# EAGLE design STM32F2 Controller (EAGLE 6.3)
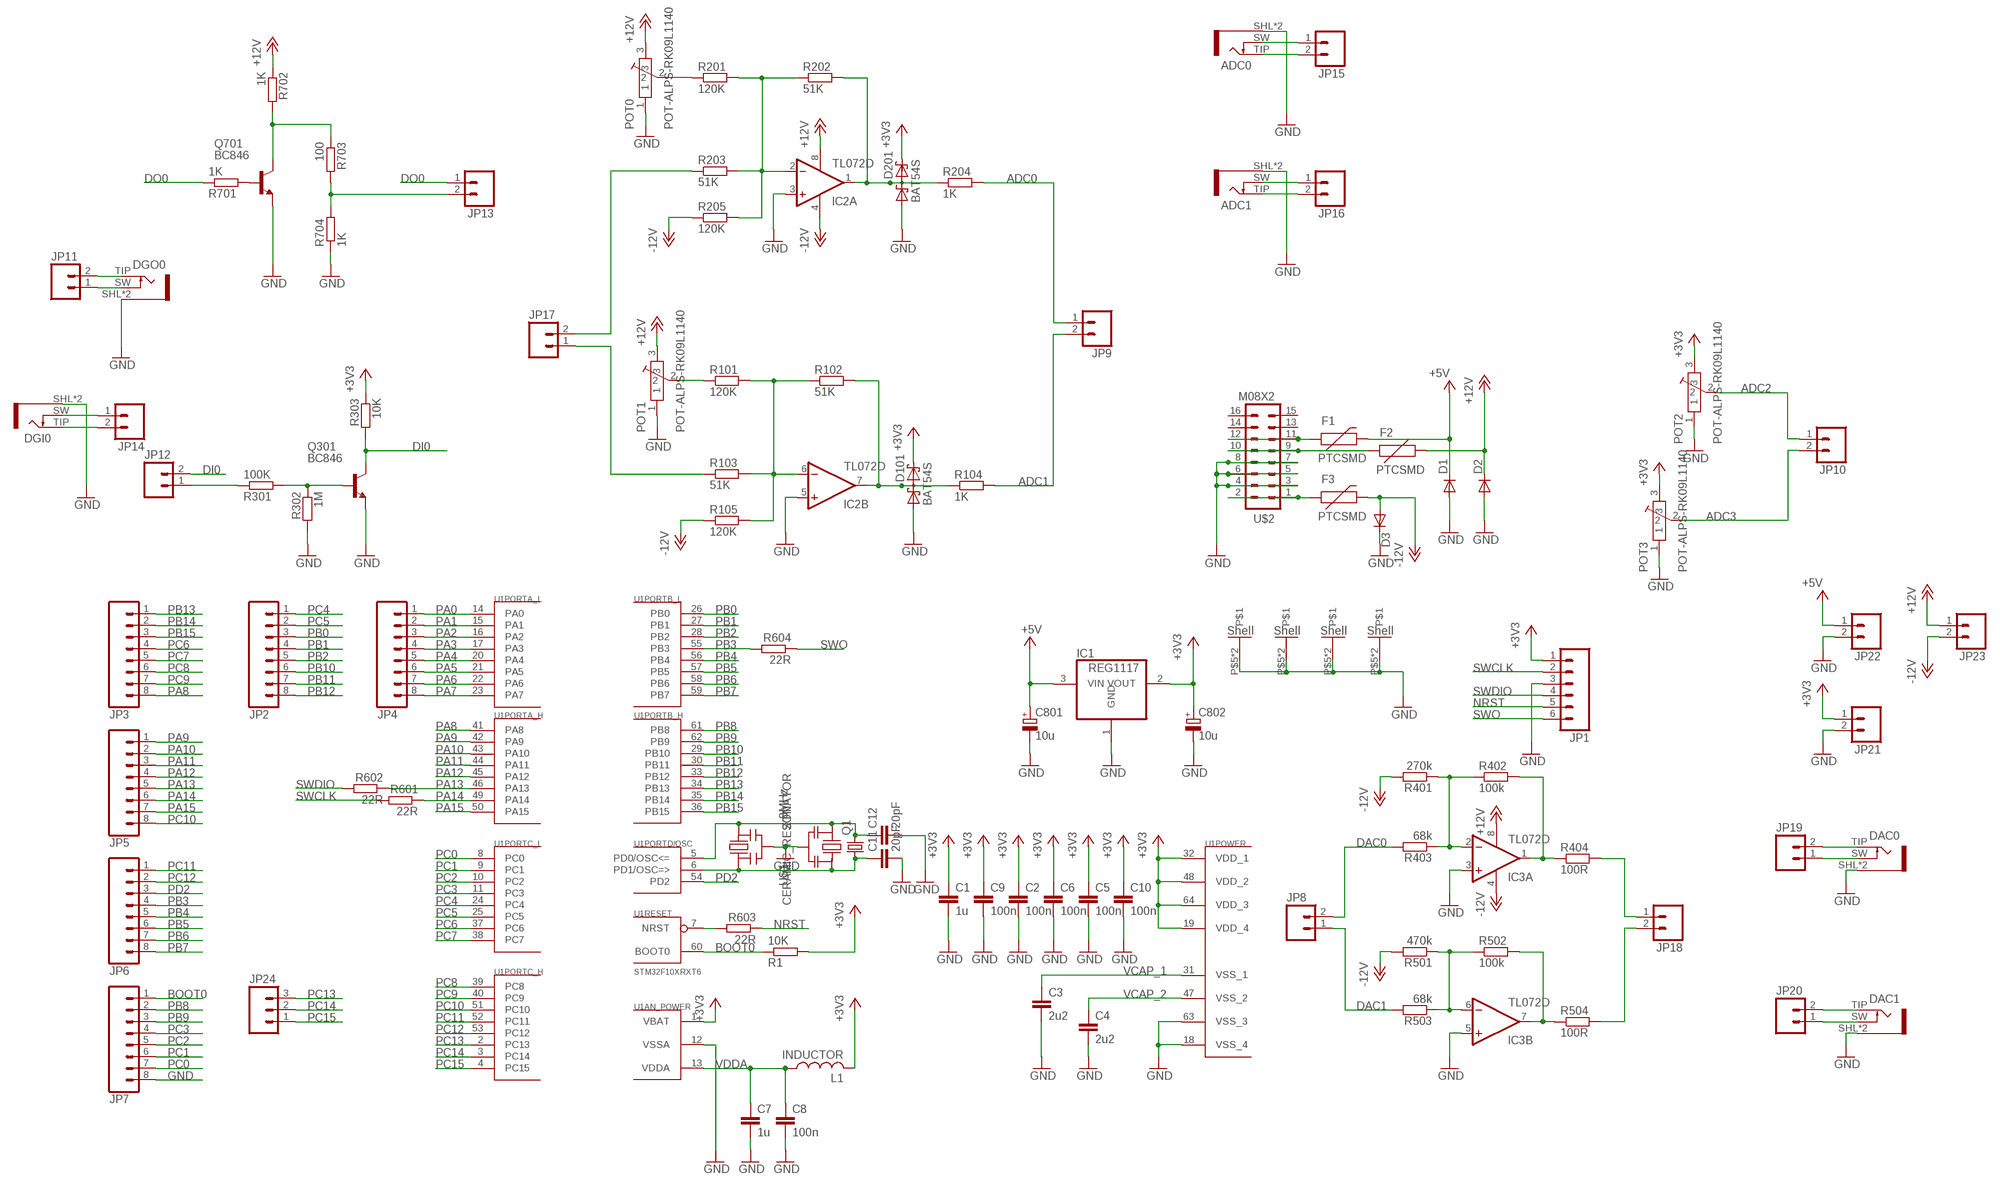
[diagram p0: schematic, sheet 1]

## Parts
ADC0  JACK-PJ-301B  [PJ-301B]
ADC1  JACK-PJ-301B  [PJ-301B]
C1  1u  C-EUC0603  [C0603]
C2  100n  C-EUC0603  [C0603]
C3  2u2  C-EUC0603  [C0603]
C4  2u2  C-EUC0603  [C0603]
C5  100n  C-EUC0603  [C0603]
C6  100n  C-EUC0603  [C0603]
C7  1u  C-EUC0603  [C0603]
C8  100n  C-EUC0603  [C0603]
C9  100n  C-EUC0603  [C0603]
C10  100n  C-EUC0603  [C0603]
C11  20pF  C-EUC0603  [C0603]
C12  20pF  C-EUC0603  [C0603]
C801  10u  CPOL-EUA  [PANASONIC_A]
C802  10u  CPOL-EUA  [PANASONIC_A]
D1  DIODESMA  [SMA-DIODE]
D2  DIODESMA  [SMA-DIODE]
D3  DIODESMA  [SMA-DIODE]
D101  BAT54S  [SOT23]
D201  BAT54S  [SOT23]
DAC0  JACK-PJ-301B  [PJ-301B]
DAC1  JACK-PJ-301B  [PJ-301B]
DGI0  JACK-PJ-301B  [PJ-301B]
DGO0  JACK-PJ-301B  [PJ-301B]
F1  PTCSMD  [PTC-1206]
F2  PTCSMD  [PTC-1206]
F3  PTCSMD  [PTC-1206]
IC1  REG1117  [SOT223]
IC2  TL072D  [SO08]
IC3  TL072D  [SO08]
JP1  M06SIP  [1X06]
JP2  M081X08  [1X08]
JP3  M081X08  [1X08]
JP4  M081X08  [1X08]
JP5  M081X08  [1X08]
JP6  M081X08  [1X08]
JP7  M081X08  [1X08]
JP8  M02PTH  [1X02]
JP9  M02PTH  [1X02]
JP10  M02PTH  [1X02]
JP11  M02PTH  [1X02]
JP12  M02PTH  [1X02]
JP13  M02PTH  [1X02]
JP14  M02PTH  [1X02]
JP15  M02PTH  [1X02]
JP16  M02PTH  [1X02]
JP17  M02PTH  [1X02]
JP18  M02PTH  [1X02]
JP19  M02PTH  [1X02]
JP20  M02PTH  [1X02]
JP21  M02PTH  [1X02]
JP22  M02PTH  [1X02]
JP23  M02PTH  [1X02]
JP24  M03PTH  [1X03]
L1  INDUCTOR  [0603]
POT0  POT-ALPS-RK09L1140  [POT-ALPS-RK09L1140]
POT1  POT-ALPS-RK09L1140  [POT-ALPS-RK09L1140]
POT2  POT-ALPS-RK09L1140  [POT-ALPS-RK09L1140]
POT3  POT-ALPS-RK09L1140  [POT-ALPS-RK09L1140]
Q1  CRYSTALHC49UP  [HC49UP]
Q301  BC846  [SOT23]
Q701  BC846  [SOT23]
R1  10K  R-EU_R0603  [R0603]
R101  120K  R-EU_R0603  [R0603]
R102  51K  R-EU_R0603  [R0603]
R103  51K  R-EU_R0603  [R0603]
R104  1K  R-EU_R0603  [R0603]
R105  120K  R-EU_R0603  [R0603]
R201  120K  R-EU_R0603  [R0603]
R202  51K  R-EU_R0603  [R0603]
R203  51K  R-EU_R0603  [R0603]
R204  1K  R-EU_R0603  [R0603]
R205  120K  R-EU_R0603  [R0603]
R301  100K  R-EU_R0603  [R0603]
R302  1M  R-EU_R0603  [R0603]
R303  10K  R-EU_R0603  [R0603]
R401  270k  R-EU_R0603  [R0603]
R402  100k  R-EU_R0603  [R0603]
R403  68k  R-EU_R0603  [R0603]
R404  100R  R-EU_R0603  [R0603]
R501  470k  R-EU_R0603  [R0603]
R502  100k  R-EU_R0603  [R0603]
R503  68k  R-EU_R0603  [R0603]
R504  100R  R-EU_R0603  [R0603]
R601  22R  R-EU_R0603  [R0603]
R602  22R  R-EU_R0603  [R0603]
R603  22R  R-EU_R0603  [R0603]
R604  22R  R-EU_R0603  [R0603]
R701  1K  R-EU_R0603  [R0603]
R702  1K  R-EU_R0603  [R0603]
R703  100  R-EU_R0603  [R0603]
R704  1K  R-EU_R0603  [R0603]
U1  STM32F10XRXT6  [TQFP64]
U$1  8MHz  CERMOSCILL-CSTCRG  [CSTCR-G]
U$2  M08X2  [2X8]
ZTT  CERAMIC_RESONATOR  [CSTCE_G_A]

## Nets
+3V3: C1.1 C2.1 C5.1 C6.1 C9.1 C10.1 C802.+ D101.2(C2) D201.2(C2) IC1.2(VOUT) JP1.1 JP21.1 L1.2 POT2.3 POT3.3 R1.2 R303.1 U1.1(AN_POWER:VBAT) U1.19(POWER:VDD_4) U1.32(POWER:VDD_1) U1.48(POWER:VDD_2) U1.64(POWER:VDD_3)
+5V: C801.+ D1.C F1.2 IC1.3(VIN) JP22.1
+12V: D2.C F2.2 IC2.8(P:V+) IC3.8(P:V+) JP23.1 POT0.3 POT1.3 R702.1
-12V: D3.A F3.2 IC2.4(P:V-) IC3.4(P:V-) JP23.2 R105.1 R205.1 R401.2 R501.2
ADC0: JP9.1 R204.2
ADC1: JP9.2 R104.2
ADC2: JP10.1 POT2.2
ADC3: JP10.2 POT3.2
BOOT0: JP7.1 R1.1 U1.60(RESET:BOOT0)
DAC0: JP8.2 R403.2
DAC1: JP8.1 R503.2
DI0: JP12.2 Q301.3(C) R303.2
DO0: JP13.1 R701.1
GND: ADC0.SHL(SLEEVE) ADC0.SLV(SLEEVE) ADC1.SHL(SLEEVE) ADC1.SLV(SLEEVE) C1.2 C2.2 C3.2 C4.2 C5.2 C6.2 C7.2 C8.2 C9.2 C10.2 C11.2 C12.2 C801.- C802.- D1.A D2.A D3.C D101.1(A1) D201.1(A1) DAC0.SHL(SLEEVE) DAC0.SLV(SLEEVE) DAC1.SHL(SLEEVE) DAC1.SLV(SLEEVE) DGI0.SHL(SLEEVE) DGI0.SLV(SLEEVE) DGO0.SHL(SLEEVE) DGO0.SLV(SLEEVE) IC1.1(GND) IC2.3(A:+IN) IC2.5(B:+IN) IC3.3(A:+IN) IC3.5(B:+IN) JP1.3 JP7.8 JP21.2 JP22.2 POT0.1 POT0.P$5 POT0.P$6 POT1.1 POT1.P$5 POT1.P$6 POT2.1 POT2.P$5 POT2.P$6 POT3.1 POT3.P$5 POT3.P$6 Q301.2(E) Q701.2(E) R302.2 R704.1 U1.12(AN_POWER:VSSA) U1.18(POWER:VSS_4) U1.63(POWER:VSS_3) U$1.2(GND) U$2.3 U$2.4 U$2.5 U$2.6 U$2.7 U$2.8 ZTT.P$2(GND)
N$1: ADC0.SW JP15.1
N$2: IC2.6(B:-IN) R101.2 R102.1 R103.2 R105.2
N$3: POT1.2 R101.1
N$4: D101.3(C1A2) IC2.7(B:OUT) R102.2 R104.1
N$5: IC3.7(B:OUT) R502.2 R504.1
N$6: F3.1 U$2.1 U$2.2
N$7: IC3.1(A:OUT) R402.2 R404.1
N$8: DAC0.SW JP19.1
N$9: DAC0.TIP JP19.2
N$10: DGO0.SW JP11.1
N$11: DGO0.TIP JP11.2
N$13: IC3.2(A:-IN) R401.1 R402.1 R403.1
N$14: IC2.2(A:-IN) R201.2 R202.1 R203.2 R205.2
N$15: POT0.2 R201.1
N$16: D201.3(C1A2) IC2.1(A:OUT) R202.2 R204.1
N$17: ADC0.TIP JP15.2
N$18: IC3.6(B:-IN) R501.1 R502.1 R503.1
N$19: C12.1 Q1.2 U1.5(PORTD/OSC:PD0/OSC<=) U$1.3(OUT) ZTT.P$1(IN)
N$20: C11.1 Q1.1 U1.6(PORTD/OSC:PD1/OSC=>) U$1.1(IN) ZTT.P$3(OUT)
N$21: JP12.1 R301.1
N$22: DGI0.SW JP14.1
N$23: DGI0.TIP JP14.2
N$24: ADC1.SW JP16.1
N$25: ADC1.TIP JP16.2
N$26: JP17.2 R203.1
N$27: Q301.1(B) R301.2 R302.1
N$28: JP17.1 R103.1
N$29: DAC1.SW JP20.1
N$30: DAC1.TIP JP20.2
N$31: JP18.1 R404.2
N$32: JP18.2 R504.2
N$34: Q701.1(B) R701.2
N$35: JP13.2 R703.2 R704.2
N$38: Q701.3(C) R702.2 R703.1
N$44: F1.1 U$2.11 U$2.12
N$45: F2.1 U$2.9 U$2.10
NRST: JP1.5 R603.1
PA0: JP4.1 U1.14(PORTA_L:PA0)
PA1: JP4.2 U1.15(PORTA_L:PA1)
PA2: JP4.3 U1.16(PORTA_L:PA2)
PA3: JP4.4 U1.17(PORTA_L:PA3)
PA4: JP4.5 U1.20(PORTA_L:PA4)
PA5: JP4.6 U1.21(PORTA_L:PA5)
PA6: JP4.7 U1.22(PORTA_L:PA6)
PA7: JP4.8 U1.23(PORTA_L:PA7)
PA8: JP3.8 U1.41(PORTA_H:PA8)
PA9: JP5.1 U1.42(PORTA_H:PA9)
PA10: JP5.2 U1.43(PORTA_H:PA10)
PA11: JP5.3 U1.44(PORTA_H:PA11)
PA12: JP5.4 U1.45(PORTA_H:PA12)
PA13: JP5.5 R602.1 U1.46(PORTA_H:PA13)
PA14: JP5.6 R601.1 U1.49(PORTA_H:PA14)
PA15: JP5.7 U1.50(PORTA_H:PA15)
PB0: JP2.3 U1.26(PORTB_L:PB0)
PB1: JP2.4 U1.27(PORTB_L:PB1)
PB2: JP2.5 U1.28(PORTB_L:PB2)
PB3: JP6.4 R604.2 U1.55(PORTB_L:PB3)
PB4: JP6.5 U1.56(PORTB_L:PB4)
PB5: JP6.6 U1.57(PORTB_L:PB5)
PB6: JP6.7 U1.58(PORTB_L:PB6)
PB7: JP6.8 U1.59(PORTB_L:PB7)
PB8: JP7.2 U1.61(PORTB_H:PB8)
PB9: JP7.3 U1.62(PORTB_H:PB9)
PB10: JP2.6 U1.29(PORTB_H:PB10)
PB11: JP2.7 U1.30(PORTB_H:PB11)
PB12: JP2.8 U1.33(PORTB_H:PB12)
PB13: JP3.1 U1.34(PORTB_H:PB13)
PB14: JP3.2 U1.35(PORTB_H:PB14)
PB15: JP3.3 U1.36(PORTB_H:PB15)
PC0: JP7.7 U1.8(PORTC_L:PC0)
PC1: JP7.6 U1.9(PORTC_L:PC1)
PC2: JP7.5 U1.10(PORTC_L:PC2)
PC3: JP7.4 U1.11(PORTC_L:PC3)
PC4: JP2.1 U1.24(PORTC_L:PC4)
PC5: JP2.2 U1.25(PORTC_L:PC5)
PC6: JP3.4 U1.37(PORTC_L:PC6)
PC7: JP3.5 U1.38(PORTC_L:PC7)
PC8: JP3.6 U1.39(PORTC_H:PC8)
PC9: JP3.7 U1.40(PORTC_H:PC9)
PC10: JP5.8 U1.51(PORTC_H:PC10)
PC11: JP6.1 U1.52(PORTC_H:PC11)
PC12: JP6.2 U1.53(PORTC_H:PC12)
PC13: JP24.3 U1.2(PORTC_H:PC13)
PC14: JP24.2 U1.3(PORTC_H:PC14)
PC15: JP24.1 U1.4(PORTC_H:PC15)
PD2: JP6.3 U1.54(PORTD/OSC:PD2)
RST: R603.2 U1.7(RESET:NRST)
SWCLK: JP1.2 R601.2
SWDIO: JP1.4 R602.2
SWO: JP1.6 R604.1
VCAP_1: C3.1 U1.31(POWER:VSS_1)
VCAP_2: C4.1 U1.47(POWER:VSS_2)
VDDA: C7.1 C8.1 L1.1 U1.13(AN_POWER:VDDA)
Unconnected: U$2.13 U$2.14 U$2.15 U$2.16

## Library data of the parts
ADC0 ADC1 DAC0 DAC1 DGI0 DGO0 = Rebel:JACK-PJ-301B
C1-C12 = resistor:C-EU: CAPACITOR, European symbol
C801 C802 = resistor:CPOL-EU: POLARIZED CAPACITOR, European symbol
D1-D3 = SparkFun:DIODE: Diode These are standard reverse protection diodes and small signal diodes. SMA package can handle up to about 1A. SOD-323 can handle about 200mA. What the SOD-323 package when ordering, there are some mfgs out there that are 5-pin packages.
D101 D201 = diode:BAT54S: Schottky Diodes Pin connection corrected 2011-05-04 Source: Fairchild .. BAT54.pdf
F1-F3 = SparkFun:PTC: Resettable Fuse PTC Resettable Fuse. Spark Fun Electronics SKU : COM-08357
IC1 = burr-brown:REG1117: 800mA and 1A Low Dropout (LDO) Positive Regulator 1.8V, 2.5V, 2.85V, 3.3V, 5V, and Adj; MPN: REG1117; OC_FARNELL: 1097566; OC_NEWARK: 14P6981
IC2 IC3 = linear:TL072: OP AMP
JP1 = SparkFun:M06: Header 6 Standard 6-pin 0.1" header. Use with straight break away headers (SKU : PRT-00116), right angle break away headers (PRT-00553), swiss pins (PRT-00743), machine pins (PRT-00117), and female headers (PRT-00115). Molex polarized connector foot print use with SKU : PRT-08094 with associated crimp pins and housings. NOTES ON THE VARIANTS LOCK and LOCK_LONGPADS... This footprint was designed to help hold the alignment of a through-hole component (i.e. 6-pin header) while soldering it into place. You may notice that each hole has been shifted either up or down by 0.005 of an inch from it's more standard position (which is a perfectly straight line). This slight alteration caused the pins (the squares in the middle) to touch the edges of the holes. Because they are alternating, it causes a "brace" to hold the component in place. 0.005 has proven to be the perfect amount of "off-center" position when using our standard breakaway headers. Although looks a little odd when you look at the bare footprint, once you have a header in there, the alteration is very hard to notice. Also, if you push a header all the way into place, it is covered up entirely on the bottom side. This idea of altering the position of holes to aid alignment will be further integrated into the Sparkfun Library for other footprints. It can help hold any component with 3 or more connection pins.
JP2-JP7 = SparkFun:M08: Header 8 Standard 8-pin 0.1" header. Use with straight break away headers (SKU : PRT-00116), right angle break away headers (PRT-00553), swiss pins (PRT-00743), machine pins (PRT-00117), and female headers (PRT-00115).
JP8-JP23 = SparkFun:M02: Header 2 Standard 2-pin 0.1" header. Use with straight break away headers (SKU : PRT-00116), right angle break away headers (PRT-00553), swiss pins (PRT-00743), machine pins (PRT-00117), and female headers (PRT-00115). Molex polarized connector foot print use with SKU : PRT-08233 with associated crimp pins and housings.
JP24 = SparkFun:M03: Header 3 Standard 3-pin 0.1" header. Use with straight break away headers (SKU : PRT-00116), right angle break away headers (PRT-00553), swiss pins (PRT-00743), machine pins (PRT-00117), and female headers (PRT-00115). Molex polarized connector foot print use with SKU : PRT-08232 with associated crimp pins and housings.
L1 = Rebel:INDUCTOR
POT0 POT1-POT3 = Rebel:POT-ALPS-RK09L
Q1 = crystal:CRYSTAL: CRYSTAL; OC_FARNELL: unknown; OC_NEWARK: unknown
Q301 Q701 = transistor:BC846: NPN TRANSISTOR
R1 R101-R105 R201-R205 R301-R303 R401-R404 R501-R504 R601-R604 R701-R704 = resistor:R-EU_: RESISTOR, European symbol
U1 = stm32:STM32F10XRXT6: STM32F101/103 64pin LQFP
U$1 = adafruit:CERMOSCILL: Ceramic oscillator with built in capacitors such as ZTT-12MHz http://www.ladyada.net/library/eagle
U$2 = SparkFun:M08X2
ZTT = Rebel:CERAMIC_RESONATOR: Murata Ceralock Ceramic Resonators. CSTCC_G 2.00 - 3.99MHz CSTCR_G 4.00 - 7.99MHz CSTCE_G 8.00 - 13.99MHz

## Board
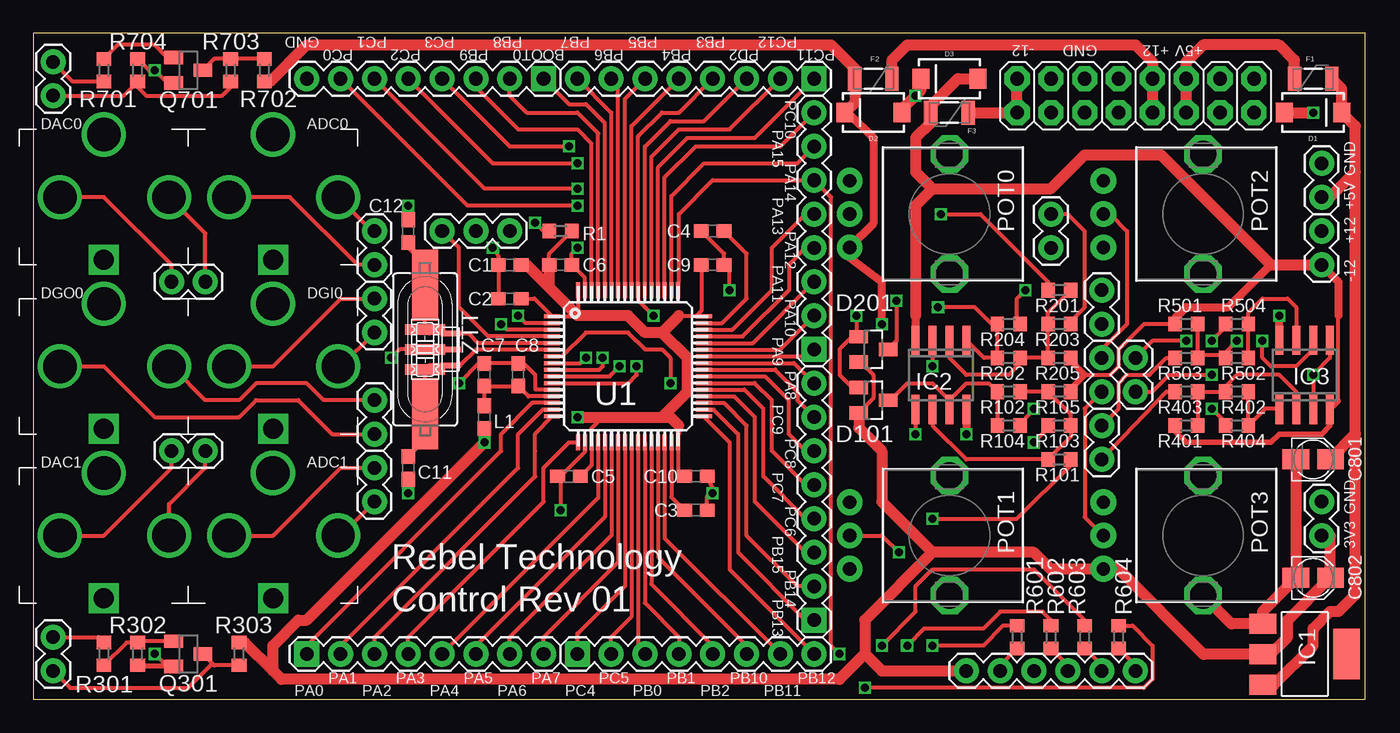
[diagram p1: board, top side]
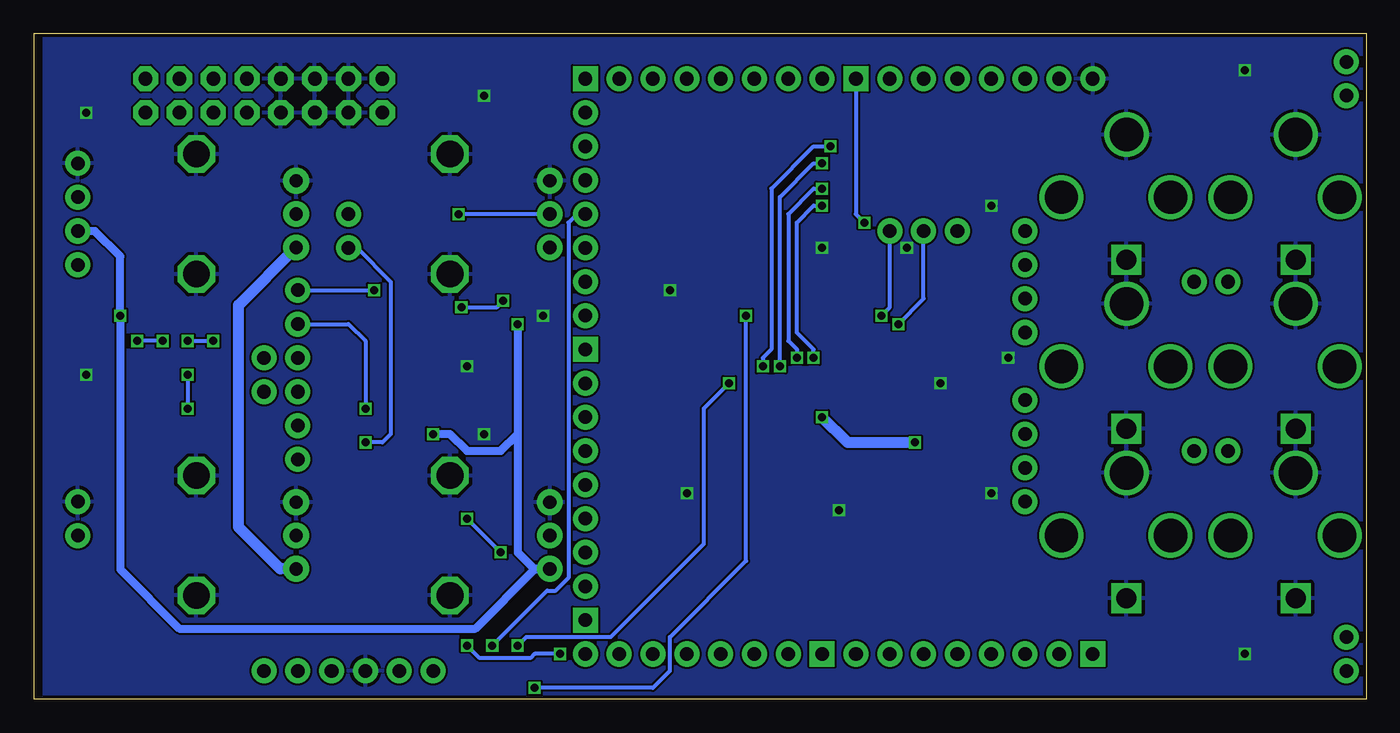
[diagram p2: board, bottom side, seen from below]

Size 100 x 50 mm. Coordinates in mm from the lower left corner, seen from the top.
Outline: 0,0 100,0 100,50 0,50 0,0
Copper layers (1*16): Top 0.035mm / dielectric 1.5mm / Bottom 0.035mm
Design rules "Rebel *": minimum track width 6mil, minimum drill 12mil, track to track 6mil, track to pad 6mil, pad to pad 6mil, via to via 6mil, smd to smd 0mil, copper to edge 10mil, drill to drill 10mil, minimum pad ring 12mil, minimum via ring 6mil, stop-mask expansion 2mil, vias tented up to drill 100mil, thermal gap 10mil

### Footprints (pad centres in the part's own frame; a part is rotated, then mirrored left to right if it is on the bottom)
PJ-301B = drill 1.5 square: SHL 4.7,0 | drill 2.5: SLV -4.7,0; SW 0,-3.3; TIP 0,4.9
C0603 = smd 1.1 x 1: 1 -0.85,0; 2 0.85,0
PANASONIC_A = smd 2 x 1.5: + 1.3,0; - -1.3,0
SMA-DIODE = smd 1.27 x 1.47: A -2.15,0; C 2.15,0
SOT23 = smd 1 x 1.4: 1 -0.95,-1.1; 2 0.95,-1.1; 3 0,1.1
PTC-1206 = smd 1 x 1.8: 1 -1.4,0; 2 1.4,0
SOT223 = smd 1.499 x 2.007: 1 -2.261,-3.15; 2 0.025,-3.15; 3 2.311,-3.15 | smd 3.81 x 2.007: 4 0,3.15
SO08 = smd 0.6 x 2.2: 1 -1.905,-2.6; 2 -0.635,-2.6; 3 0.635,-2.6; 4 1.905,-2.6; 5 1.905,2.6; 6 0.635,2.6; 7 -0.635,2.6; 8 -1.905,2.6
1X06 = drill 1.016 pad 1.88: 1 0,0; 2 2.54,0; 3 5.08,0; 4 7.62,0; 5 10.16,0; 6 12.7,0
1X08 = drill 1.016 pad 1.88 square: 1 0,0 | drill 1.016 pad 1.88: 2 2.54,0; 3 5.08,0; 4 7.62,0; 5 10.16,0; 6 12.7,0; 7 15.24,0; 8 17.78,0
1X02 = drill 1.016 pad 1.88: 1 0,0; 2 2.54,0
1X03 = drill 1.016 pad 1.88: 1 0,0; 2 2.54,0; 3 5.08,0
0603 = smd 1.1 x 1: 1 -0.85,0; 2 0.85,0
POT-ALPS-RK09L1140 = drill 1 pad 1.93: 1 -2.5,-7.5; 2 0,-7.5; 3 2.5,-7.5 | drill 2 octagon: P$5 -4.5,0; P$6 4.5,0
HC49UP = smd 5.334 x 1.93: 1 -4.826,0; 2 4.826,0
R0603 = smd 1 x 1.1: 1 -0.85,0; 2 0.85,0
TQFP64 = smd 1.2 x 0.3: 1 -5.7,3.75; 2 -5.7,3.25; 3 -5.7,2.75; 4 -5.7,2.25; 5 -5.7,1.75; 6 -5.7,1.25; 7 -5.7,0.75; 8 -5.7,0.25; 9 -5.7,-0.25; 10 -5.7,-0.75; 11 -5.7,-1.25; 12 -5.7,-1.75; 13 -5.7,-2.25; 14 -5.7,-2.75; 15 -5.7,-3.25; 16 -5.7,-3.75; 33 5.7,-3.75; 34 5.7,-3.25; 35 5.7,-2.75; 36 5.7,-2.25; 37 5.7,-1.75; 38 5.7,-1.25; 39 5.7,-0.75; 40 5.7,-0.25; 41 5.7,0.25; 42 5.7,0.75; 43 5.7,1.25; 44 5.7,1.75; 45 5.7,2.25; 46 5.7,2.75; 47 5.7,3.25; 48 5.7,3.75 | smd 0.3 x 1.2: 17 -3.75,-5.7; 18 -3.25,-5.7; 19 -2.75,-5.7; 20 -2.25,-5.7; 21 -1.75,-5.7; 22 -1.25,-5.7; 23 -0.75,-5.7; 24 -0.25,-5.7; 25 0.25,-5.7; 26 0.75,-5.7; 27 1.25,-5.7; 28 1.75,-5.7; 29 2.25,-5.7; 30 2.75,-5.7; 31 3.25,-5.7; 32 3.75,-5.7; 49 3.75,5.7; 50 3.25,5.7; 51 2.75,5.7; 52 2.25,5.7; 53 1.75,5.7; 54 1.25,5.7; 55 0.75,5.7; 56 0.25,5.7; 57 -0.25,5.7; 58 -0.75,5.7; 59 -1.25,5.7; 60 -1.75,5.7; 61 -2.25,5.7; 62 -2.75,5.7; 63 -3.25,5.7; 64 -3.75,5.7
CSTCR-G = smd 0.8 x 3: 1 -1.5,0; 2 0,0; 3 1.5,0
2X8 = drill 1.016 pad 1.88 octagon: 1 0,0; 2 0,2.54; 3 2.54,0; 4 2.54,2.54; 5 5.08,0; 6 5.08,2.54; 7 7.62,0; 8 7.62,2.54; 9 10.16,0; 10 10.16,2.54; 11 12.7,0; 12 12.7,2.54; 13 15.24,0; 14 15.24,2.54; 15 17.78,0; 16 17.78,2.54
CSTCE_G_A = smd 0.4 x 1.5: P$1 -1.2,0; P$2 0,0; P$3 1.2,0

### Placement (x,y rotation side)
ADC0  18,37.7 270 top
ADC1  18,12.3 270 top
C1  35.78,32.62 180 top
C2  35.78,30.08 180 top
C3  49.75,14.21 0 top
C4  51.02,35.16 180 top
C5  40.22,16.75 180 top
C6  39.59,32.62 0 top
C7  33.87,24.37 90 top
C8  36.41,24.37 90 top
C9  51.02,32.62 0 top
C10  49.75,16.75 0 top
C11  28.16,17.38 270 top
C12  28.16,35.16 90 top
C801  96.1,18.02 0 top
C802  96.1,9.12 0 top
D1  96.1,44.05 0 top
D2  63.08,44.05 180 top
D3  68.8,46.59 180 top
D101  63.08,22.46 270 top
D201  63.08,26.27 270 top
DAC0  5.3,37.7 270 top
DAC1  5.3,12.3 270 top
DGI0  18,25 270 top
DGO0  5.3,25 270 top
F1  96.1,46.59 0 top
F2  63.08,46.59 180 top
F3  68.8,44.05 180 top
IC1  95.47,3.41 270 top
IC2  68.16,24.37 180 top
IC3  95.47,24.37 0 top
JP1  70.07,2.14 0 top
JP2  40.86,3.41 0 top
JP3  58.64,5.95 90 top
JP4  20.54,3.41 0 top
JP5  58.64,26.27 90 top
JP6  58.64,46.59 180 top
JP7  38.32,46.59 180 top
JP8  80.23,20.55 270 top
JP9  80.23,30.71 270 top
JP10  80.23,25.64 270 top
JP11  25.62,19.92 90 top
JP12  1.49,4.68 270 top
JP13  1.49,47.86 270 top
JP14  25.62,30.08 270 top
JP15  25.62,32.62 90 top
JP16  25.62,17.38 270 top
JP17  76.42,33.89 90 top
JP18  82.77,23.1 90 top
JP19  10.38,31.35 0 top
JP20  10.38,18.65 0 top
JP21  96.74,12.3 90 top
JP22  96.74,37.7 90 top
JP23  96.74,35.16 270 top
JP24  30.7,35.16 0 top
L1  33.87,21.19 270 top
POT0  68.8,36.43 270 top
POT1  68.8,12.3 270 top
POT2  87.85,36.43 270 top
POT3  87.85,12.3 270 top
Q1  29.43,26.27 90 top
Q301  11.65,3.41 270 top
Q701  11.65,47.23 270 top
R1  39.59,35.16 0 top
R101  77.05,18.02 180 top
R102  73.24,23.1 180 top
R103  77.05,20.55 0 top
R104  73.24,20.55 0 top
R105  77.05,23.1 180 top
R201  77.05,30.71 0 top
R202  73.24,25.64 180 top
R203  77.05,28.18 180 top
R204  73.24,28.18 0 top
R205  77.05,25.64 180 top
R301  5.3,3.41 270 top
R302  7.84,3.41 270 top
R303  15.46,3.41 270 top
R401  86.58,20.55 180 top
R402  90.39,23.1 0 top
R403  86.58,23.1 180 top
R404  90.39,20.55 180 top
R501  86.58,28.18 180 top
R502  90.39,25.64 0 top
R503  86.58,25.64 180 top
R504  90.39,28.18 180 top
R601  73.88,4.68 270 top
R602  76.42,4.68 270 top
R603  78.96,4.68 90 top
R604  81.5,4.68 90 top
R701  5.3,47.23 90 top
R702  17.36,47.23 90 top
R703  14.82,47.23 270 top
R704  7.84,47.23 270 top
U1  44.67,25 0 top
U$1  29.43,26.27 90 top
U$2  73.88,44.05 0 top
U$3  [RT-LOGO-35MM-BL]  51.97,43.73 270 top
ZTT  31.33,26.27 270 top

### Tracks (layer width: path | path; a pad name or v marks a point on that pad's centre or on a via)
+3V3  (via drill 0.6)
  Top 0.305: C5.1 41.92,17.59 U1.19 41.92,20.35 42.76,21.19 47.21,21.19 | C10.1 48.42,17.23 U1.32 48.42,20.5 48.48,20.55 48.48,19.92 | D201.2 62.13,25.32 63.08,24.37 63.08,22.61 D101.2 | 42.07,28.75 44.67,28.81 | U1.64 40.92,28.87 40.86,28.81 40.8,28.75 U1.1 37.64,30.08 C2.1 | C6.1 38.74,33.46 R1.2 | C9.1 50.17,29.17 49.75,28.75 | U1.48 49.75,28.75 | 49.75,28.75 48.54,28.75 48.48,28.81
  Top 0.813: 80.39,9.76 81.5,9.76 87.87,3.39 IC1.2 92.9,3.39 94.2,4.68 94.2,5.95 97.4,9.15 C802.+ 97.4,12.27 JP21.1 | 80.39,9.76 POT3.3 | 80.39,9.76 76.42,9.76 75.15,11.03 67.53,11.03 | 67.53,11.03 62.45,5.95 62.45,3.41 | 62.45,3.41 60.54,1.5 18.63,1.5 18,2.14 | D101.2 61.98,20.39 63.72,18.65 63.72,14.84 67.53,11.03 | v40.86,21.19 47.21,21.19 | 47.21,21.19 47.84,21.19 48.48,20.55 | 47.21,21.19 49.11,23.1 49.11,25.64 47.21,27.54 | 18,2.14 18,4.04 19.9,5.95 20.54,5.95 v33.87,19.29 L1.2 | R303.1 15.88,4.26 18,2.14 | 62.45,3.41 63.72,2.14 JP1.1 | 47.21,27.54 45.94,27.54 44.67,28.81 40.86,28.81 38.74,30.93 | 38.74,30.93 37.05,32.62 C1.1 | 47.21,27.54 48.48,28.81 | C6.1 38.74,30.93
  Bottom 0.813: POT3.3 81.54,9.8 84.67,12.94 84.67,29.61 POT2.3 | v40.86,21.19 38.95,19.29 v33.87,19.29
+5V
  Top 0.813: F1.2 98.25,45.84 D1.C 99.28,43.02 99.28,39.61 | IC1.3 93.16,1.1 96.1,4.04 96.1,5.31 97.37,6.58 98.01,6.58 99.28,7.86 99.28,19.95 | 99.28,19.95 C801.+ | 99.28,19.95 99.28,39.61 | JP22.1 97.37,37.7 99.28,39.61
+12V  (via drill 0.6)
  Top 0.61: D2.C 61.18,44.05 63.08,42.15 63.08,35.72 POT0.3 61.18,33.81 61.18,33.26 63.72,31.35 v63.72,28.18 | IC2.8 v70.07,19.92 | IC3.8 v93.56,28.81
  Top 0.813: R702.1 17.78,46.38 20.54,49.13 59.91,49.13 61.68,47.36 F2.2 61.68,44.8 D2.C
  Bottom 0.61: v63.72,28.18 63.72,19.92 | 63.72,19.92 63.72,11.03 62.45,9.76 | 63.72,19.92 64.99,18.65 67.53,18.65 68.8,19.92 v70.07,19.92 | JP23.1 95.47,35.16 93.56,33.26 v93.56,28.81 93.56,9.76 89.12,5.31 66.89,5.31 62.45,9.76 | 62.45,9.76 61.34,9.76 POT1.3 62.41,9.8 62.45,9.76
-12V
  Top 0.305: 98.01,22.4 98.01,28.81 | 78.96,24.37 80.86,24.37 81.5,25 81.5,26.27 83.4,28.18 R501.2 85.73,28.6
  Top 0.406: R401.2 85.73,20.14 86.58,19.29 92.93,19.29 93.56,19.92 96.74,19.92 97.37,20.55 IC3.4 98.01,22.4 | R205.1 77.9,25.42 78.96,24.37 77.9,23.31 R105.1
  Top 0.61: F3.2 67.4,43.29 | 66.26,28.81 IC2.4 | 85.73,28.6 86.58,29.45 89.75,29.45 92.93,32.62 | JP23.2 98.01,31.35 98.01,28.81
  Top 0.813: F3.2 67.4,44.55 69.43,46.59 D3.A | 67.4,43.29 66.26,42.15 66.26,39.61 67.53,38.34 | 67.53,38.34 76.42,38.34 78.96,40.88 84.67,40.88 92.93,32.62 JP23.2 | 66.26,28.81 66.26,37.07 67.53,38.34
ADC0  (via drill 0.6)
  Top 0.305: R204.2 73.88,28.39 73.88,30.08 v74.51,30.71
  Bottom 0.305: JP9.1 v74.51,30.71
ADC1  (via drill 0.6)
  Top 0.305: v75.15,21.83 73.88,20.34 R104.2
  Bottom 0.305: JP9.2 76.42,28.18 75.15,26.91 v75.15,21.83
ADC2
  Top 0.305: POT2.2 80.86,36.43 82.13,35.16 82.13,28.18 80.23,26.27 JP10.1
ADC3
  Top 0.305: JP10.2 78.96,21.83 78.96,13.69 POT3.2
BOOT0  (via drill 0.6)
  Top 0.305: U1.60 42.92,43.26 41.49,44.69 40.22,44.69 JP7.1 | R1.1 38.32,35.16 v37.68,35.8
  Bottom 0.305: JP7.1 38.32,36.43 v37.68,35.8
DAC0
  Top 0.305: JP8.2 85.09,23.1 R403.2
DAC1
  Top 0.305: R503.2 85.09,25.64 83.82,24.37 82.13,24.37 81.5,23.73 81.5,21.83 JP8.1
DI0
  Top 0.305: R303.2 13.6,2.56 | 13.6,2.56 Q301.3 | JP12.2 2.76,0.87 11.65,0.87 13.34,2.56 13.6,2.56
DO0
  Top 0.305: R701.1 2.97,46.38 JP13.1
GND  (via drill 0.6)
  Top 0.305: U1.63 41.42,31.64 C6.2 40.44,33.47 v40.86,33.89 | IC3.5 97.37,25.64 v96.1,24.37 IC3.3 | IC2.3 v67.53,25 | IC2.5 v66.26,19.92 | D101.1 61.5,23.41 60.54,24.37 60.54,26.27 61.49,27.22 D201.1 61.81,27.39 v61.81,28.81 | Q301.2 7.94,2.46 R302.2 10.16,2.56 10.38,2.77 9.74,2.77 v9.11,3.41 | Q701.2 10.06,46.27 v9.11,47.23 8.69,47.23 R704.1 | C10.2 51.02,15.9 v51.02,15.47 50.6,15.26 C3.2 | C5.2 39.37,16.53 39.59,16.75 | v52.29,30.71 52.29,32.2 C9.2 51.87,33.46 C4.2 | v31.97,23.73 33.45,25.21 C7.2 C8.2 36.83,25.21 37.68,24.37 37.68,23.31 37.74,23.25 U1.12 | C2.2 C1.2 34.93,33.26 v34.51,33.89 | U1.18 41.42,18.58 39.59,16.75 | 39.59,16.75 v39.59,14.21 | C12.2 v28.16,37.07 | C11.2 v28.16,15.47 | v26.89,25.64 27.52,26.27 U$1.2 ZTT.P$2
  Top 0.813: D2.A 65.23,44.3 v66.26,45.32 66.65,45.71 D3.C | D1.A v96.1,44.05 | C801.- C802.- 94.8,9.09 92.32,6.61 IC1.1 89.97,5.67 POT3.P$6
  pour Bottom: -1.05,-0.4 -1.05,50.4 99.28,50.4 99.28,-0.4
N$1
  Top 0.305: JP15.1 24.35,32.62 19.27,37.7 ADC0.SW
N$2
  Top 0.305: R102.1 R105.2 77.9,21.4 R103.2 77.9,19.71 R101.2 70.07,18.02 67.53,20.55 IC2.6
N$3  (via drill 0.6)
  Top 0.305: POT1.2 63.72,12.3 v64.99,11.03 | v67.53,13.57 73.88,13.57 77.9,17.6 R101.1
  Bottom 0.305: v64.99,11.03 v67.53,13.57
N$4
  Top 0.305: R104.1 R102.2 71.76,23.73 70.07,23.73 68.8,22.46 | IC2.7 68.8,22.46 | 68.8,22.46 67.53,23.73 65.62,23.73 64.35,22.46 D101.3
N$5
  Top 0.305: R502.2 R504.1 91.24,29.03 92.29,30.08 94.2,30.08 94.83,29.45 IC3.7
N$6
  Top 0.813: U$2.2 U$2.1 F3.1
N$7
  Top 0.305: IC3.1 93.5,21.83 92.51,21.83 R404.1 R402.2
N$8
  Top 0.305: JP19.1 10.38,32.62 5.3,37.7 DAC0.SW
N$9
  Top 0.305: JP19.2 12.92,34.98 DAC0.TIP
N$10
  Top 0.305: DGO0.SW 5.3,25 9.11,21.19 15.46,21.19 16.73,22.46 19.9,22.46 22.44,19.92 JP11.1 24.98,19.92
N$11
  Top 0.305: DGO0.TIP 10.38,25 12.92,22.46 15.46,22.46 16.73,23.73 20.54,23.73 21.81,22.46 JP11.2
N$13
  Top 0.305: R401.1 R403.1 R402.1 89.54,23.52 90.39,24.37 93.56,24.37 94.83,23.1 IC3.2
N$14
  Top 0.305: IC2.2 68.8,25.64 70.07,24.37 73.24,24.37 74.09,25.21 R202.1 R205.2 R203.2 76.2,29.02 R201.2
N$15  (via drill 0.6)
  Top 0.305: R201.1 76.2,31.35 71.12,36.43 v68.16,36.43
  Bottom 0.305: POT0.2 v68.16,36.43
N$16  (via drill 0.6)
  Top 0.305: IC2.1 71.4,25.64 R202.2 R204.1 71.97,28.18 70.7,29.45 v67.95,29.45 | v64.82,29.91 64.82,26.91 D201.3
  Bottom 0.305: v67.95,29.45 65.28,29.45 v64.82,29.91
N$17
  Top 0.305: JP15.2 25.44,35.16 ADC0.TIP
N$18  (via drill 0.6)
  Top 0.305: IC3.6 96.1,26.27 94.83,25 92.93,25 92.29,25.64 v92.29,26.91 | 87.43,25.85 R501.1 | R503.1 87.43,25.85 | 89.54,25.85 87.43,25.85 | 89.54,25.85 89.54,26.05 v90.39,26.91 | 89.54,25.85 R502.1
  Bottom 0.305: v90.39,26.91 v92.29,26.91
N$19
  Top 0.305: Q1.2 U$1.3 29.73,27.47 ZTT.P$1 32.67,27.47 33.39,26.75 U1.5 | Q1.2 29.43,31.14 | C12.1 28.16,33.89 29.43,32.62 Q1.2
N$20
  Top 0.305: U1.6 33.24,26.25 32.06,25.07 ZTT.P$3 29.73,25.07 U$1.1 | 29.48,24.82 U$1.1 | U$1.1 Q1.1 29.43,19.54 C11.1
N$21
  Top 0.305: JP12.1 4.88,4.68 R301.1
N$22
  Top 0.305: DGI0.SW 18,25 23.08,30.08 JP14.1
N$23
  Top 0.305: DGI0.TIP 23.08,25 JP14.2
N$24
  Top 0.305: ADC1.SW 18,12.3 23.08,17.38 JP16.1
N$25
  Top 0.305: ADC1.TIP 23.08,12.3 JP16.2
N$26
  Top 0.305: JP17.2 77.69,36.43 78.96,35.16 78.96,29.45 77.9,28.39 R203.1
N$27
  Top 0.305: R301.2 7,4.26 R302.1 7.94,4.36 Q301.1
N$28  (via drill 0.6)
  Top 0.305: R103.1 76.2,20.34 v75.15,19.29
  Bottom 0.305: JP17.1 75.78,33.89 73.24,31.35 73.24,19.92 73.88,19.29 v75.15,19.29
N$29
  Top 0.305: DAC1.SW 5.3,12.3 10.38,17.38 JP20.1
N$30
  Top 0.305: DAC1.TIP 10.2,14.66 12.92,17.38 JP20.2
N$31  (via drill 0.6)
  Top 0.305: JP18.1 84.04,23.1 85.31,24.37 v88.48,24.37 | R404.2 89.54,20.77 v88.48,21.83
  Bottom 0.305: v88.48,24.37 v88.48,21.83
N$32  (via drill 0.6)
  Top 0.305: R504.2 89.54,27.96 v88.48,26.91 | v86.58,26.91 84.04,26.91 JP18.2
  Bottom 0.305: v88.48,26.91 v86.58,26.91
N$34
  Top 0.305: Q701.1 10.06,48.18 9.11,49.13 6.35,49.13 R701.2
N$35
  Top 0.305: R703.2 14.82,45.95 14.19,45.32 8.47,45.32 7.84,45.95 R704.2 6.78,45.32 JP13.2
N$38
  Top 0.305: R702.2 R703.1 13.6,48.08 Q701.3
N$44
  Top 0.813: U$2.11 U$2.12 86.58,47.86 87.85,49.13 93.56,49.13 94.7,47.99 F1.1
N$45
  Top 0.813: F2.1 64.48,47.99 65.62,49.13 82.77,49.13 84.04,47.86 U$2.10 U$2.9
NRST
  Top 0.305: JP1.5 80.23,2.56 R603.1
PA0
  Top 0.305: U1.14 37.47,22.25 35.14,19.92 35.14,18.65 20.54,4.04 JP4.1
PA1
  Top 0.305: U1.15 38.24,21.75 36.41,19.92 36.41,17.38 23.08,4.04 JP4.2
PA2
  Top 0.305: U1.16 37.7,19.94 37.68,18.65 37.68,16.75 25.62,4.68 JP4.3
PA3
  Top 0.305: U1.17 40.9,19.29 40.22,19.29 38.32,17.38 38.32,14.84 28.16,4.68 JP4.4
PA4
  Top 0.305: U1.20 42.42,15.13 JP4.5
PA5
  Top 0.305: U1.21 42.92,13.72 33.24,4.04 JP4.6
PA6
  Top 0.305: U1.22 43.42,12.32 35.78,4.68 JP4.7
PA7
  Top 0.305: U1.23 43.92,10.28 38.32,4.68 JP4.8
PA8
  Top 0.305: U1.41 57.12,25.25 JP3.8
PA9
  Top 0.305: U1.42 58.12,25.75 JP5.1
PA10
  Top 0.305: U1.43 56.08,26.25 JP5.2
PA11
  Top 0.305: U1.44 54.04,26.75 JP5.3
PA12
  Top 0.305: JP5.4 58,33.89 56.73,32.62 56.73,30.71 53.27,27.25 U1.45
PA13  (via drill 0.6)
  Top 0.305: JP5.5 58,36.43 55.46,33.89 55.46,30.71 52.5,27.75 U1.46 | R602.1 76.42,5.95 75.78,6.58 72.61,6.58 71.34,5.31 66.89,5.31 v65.62,4.04
  Bottom 0.305: v65.62,4.04 61.49,8.17 60.86,8.17 59.91,9.12 59.91,35.8 59.27,36.43 JP5.5
PA14  (via drill 0.6)
  Top 0.305: v60.54,3.41 59.91,4.04 59.91,37.7 JP5.6 51.02,38.97 48.48,36.43 48.48,31.35 48.42,31.29 U1.49 | R601.1 72.82,5.53 71.34,4.04 v67.53,4.04
  Bottom 0.305: v60.54,3.41 62.45,3.41 62.76,3.09 66.57,3.09 v67.53,4.04
PA15
  Top 0.305: U1.50 47.92,37.77 50.38,40.24 57.37,40.24 JP5.7
PB0
  Top 0.305: U1.26 45.42,4.16 45.94,3.64 JP2.3
PB1
  Top 0.305: U1.27 45.92,7.24 48.48,4.68 JP2.4
PB2
  Top 0.305: U1.28 46.42,8.64 51.02,4.04 JP2.5
PB3  (via drill 0.6)
  Top 0.305: JP6.4 48.48,44.05 47.21,44.05 45.42,42.26 U1.55 45.42,29.96 v46.57,28.81 | R604.2 82.55,5.53 84.04,4.04 84.04,1.5 83.4,0.87 v62.45,0.87
  Bottom 0.305: v46.57,28.81 46.57,10.39 52.29,4.68 52.29,2.14 53.56,0.87 v62.45,0.87
PB4
  Top 0.305: U1.56 44.92,43.03 JP6.5
PB5
  Top 0.305: U1.57 44.42,45.07 JP6.6
PB6
  Top 0.305: U1.58 43.92,46.07 JP6.7
PB7
  Top 0.305: U1.59 43.42,42.76 43.4,42.78 43.4,44.05 JP6.8
PB8
  Top 0.305: U1.61 42.42,42.49 40.86,44.05 37.05,44.05 35.78,45.32 JP7.2
PB9
  Top 0.305: U1.62 41.92,41.72 40.86,42.78 36.41,42.78 33.24,45.95 JP7.3
PB10
  Top 0.305: U1.29 46.92,10.69 53.56,4.04 JP2.6
PB11
  Top 0.305: U1.30 47.42,12.09 JP2.7
PB12
  Top 0.305: U1.33 50.32,21.25 52.29,19.29 52.29,9.76 JP2.8
PB13
  Top 0.305: U1.34 51.09,21.75 52.92,19.92 52.92,11.03 58,5.95 JP3.1
PB14
  Top 0.305: U1.35 51.86,22.25 53.56,20.55 53.56,12.3 57.37,8.49 JP3.2
PB15
  Top 0.305: U1.36 52.63,22.75 54.19,21.19 54.19,14.84 58,11.03 JP3.3
PC0  (via drill 0.6)
  Top 0.305: U1.8 41.11,25.25 v41.49,25.64 | v40.86,37.07 32.6,37.07 JP7.7
  Bottom 0.305: v41.49,25.64 41.49,26.27 42.76,27.54 42.76,35.8 41.49,37.07 v40.86,37.07
PC1  (via drill 0.6)
  Top 0.305: v40.86,38.34 33.87,38.34 JP7.6 | U1.9 42.51,24.75 42.76,25 v42.76,25.64
  Bottom 0.305: v40.86,38.34 41.49,38.34 43.4,36.43 43.4,26.91 42.76,26.27 v42.76,25.64
PC2  (via drill 0.6)
  Top 0.305: U1.10 43.28,24.25 v44.03,25 | JP7.5 34.51,40.24 v40.86,40.24
  Bottom 0.305: v44.03,25 44.03,37.7 41.49,40.24 v40.86,40.24
PC3  (via drill 0.6)
  Top 0.305: U1.11 44.69,23.75 45.3,24.37 v45.3,25 | JP7.4 35.78,41.51 v40.22,41.51
  Bottom 0.305: v40.22,41.51 41.49,41.51 44.67,38.34 44.67,26.27 45.3,25.64 v45.3,25
PC4
  Top 0.305: U1.24 44.42,8.49 40.86,4.93 JP2.1
PC5
  Top 0.305: U1.25 44.92,6.2 43.4,4.68 JP2.2
PC6
  Top 0.305: U1.37 53.4,23.25 54.83,21.83 54.83,16.75 58,13.57 JP3.4
PC7
  Top 0.305: U1.38 54.17,23.75 55.46,22.46 55.46,18.65 58,16.11 JP3.5
PC8
  Top 0.305: U1.39 54.94,24.25 56.73,22.46 56.73,19.92 58,18.65 JP3.6
PC9
  Top 0.305: U1.40 55.71,24.75 57.37,23.1 57.37,22.46 JP3.7
PC10
  Top 0.305: U1.51 47.42,39.18 49.75,41.51 56.1,41.51 JP5.8
PC11
  Top 0.305: U1.52 46.92,39.95 49.11,42.15 54.19,42.15 JP6.1
PC12
  Top 0.305: U1.53 46.42,40.72 48.48,42.78 52.29,42.78 JP6.2
PC13  (via drill 0.6)
  Top 0.305: U1.2 36.97,28.25 v36.41,28.81
  Bottom 0.305: v36.41,28.81 35.78,29.45 JP24.3
PC14  (via drill 0.6)
  Top 0.305: U1.3 35.57,27.75 v35.14,28.18
  Bottom 0.305: v35.14,28.18 33.24,30.08 JP24.2
PC15
  Top 0.305: U1.4 34.16,27.25 31.97,29.45 31.97,33.89 JP24.1
PD2
  Top 0.305: U1.54 45.92,41.49 47.84,43.41 50.38,43.41 JP6.3
RST  (via drill 0.6)
  Top 0.305: U1.7 39.7,25.75 41.49,27.54 44.67,27.54 45.94,26.27 47.21,26.27 47.84,25.64 v47.84,23.73 | v63.72,4.04 66.26,6.58 66.26,8.49 67.53,9.76 75.15,9.76 78.96,5.95 R603.2
  Bottom 0.305: v47.84,23.73 49.75,21.83 49.75,11.66 56.73,4.68 63.08,4.68 v63.72,4.04
SWCLK
  Top 0.305: JP1.2 72.61,2.56 R601.2
SWDIO
  Top 0.305: JP1.4 77.69,2.56 R602.2
SWO
  Top 0.305: JP1.6 82.77,2.56 R604.1
VCAP_1
  Top 0.305: U1.31 47.92,15.19 C3.1
VCAP_2
  Top 0.305: U1.47 51.73,28.25 53.56,30.08 53.56,33.47 C4.1
VDDA
  Top 0.305: U1.13 37.18,22.75 C8.1 C7.1 L1.1

### Text on the board
tPlace: GND | PC1 | PC3 | PB8 | PB7 | PB5 | PB3 | PC12 | -12 | GND | +12 | +5V | PC0 | PC2 | PB9 | BOOT0 | PB6 | PB4 | PD2 | PC11 | PC10 | PA15 | PA14 | GND | PA13 | +5V | PA12 | +12 | PA11 | -12 | PA10 | PA9 | PA8 | PC9 | PC8 | PC7 | PC6 | GND | PB15 | 3V3 | Rebel Technology | PB14 | PB13 | Control Rev 01 | PA1 | PA3 | PA5 | PA7 | PC5 | PB1 | PB10 | PB12 | PA0 | PA2 | PA4 | PA6 | PC4 | PB0 | PB2 | PB11
bStop: -12